# Altium schematic sheet esp32门锁.SchDoc
size A3
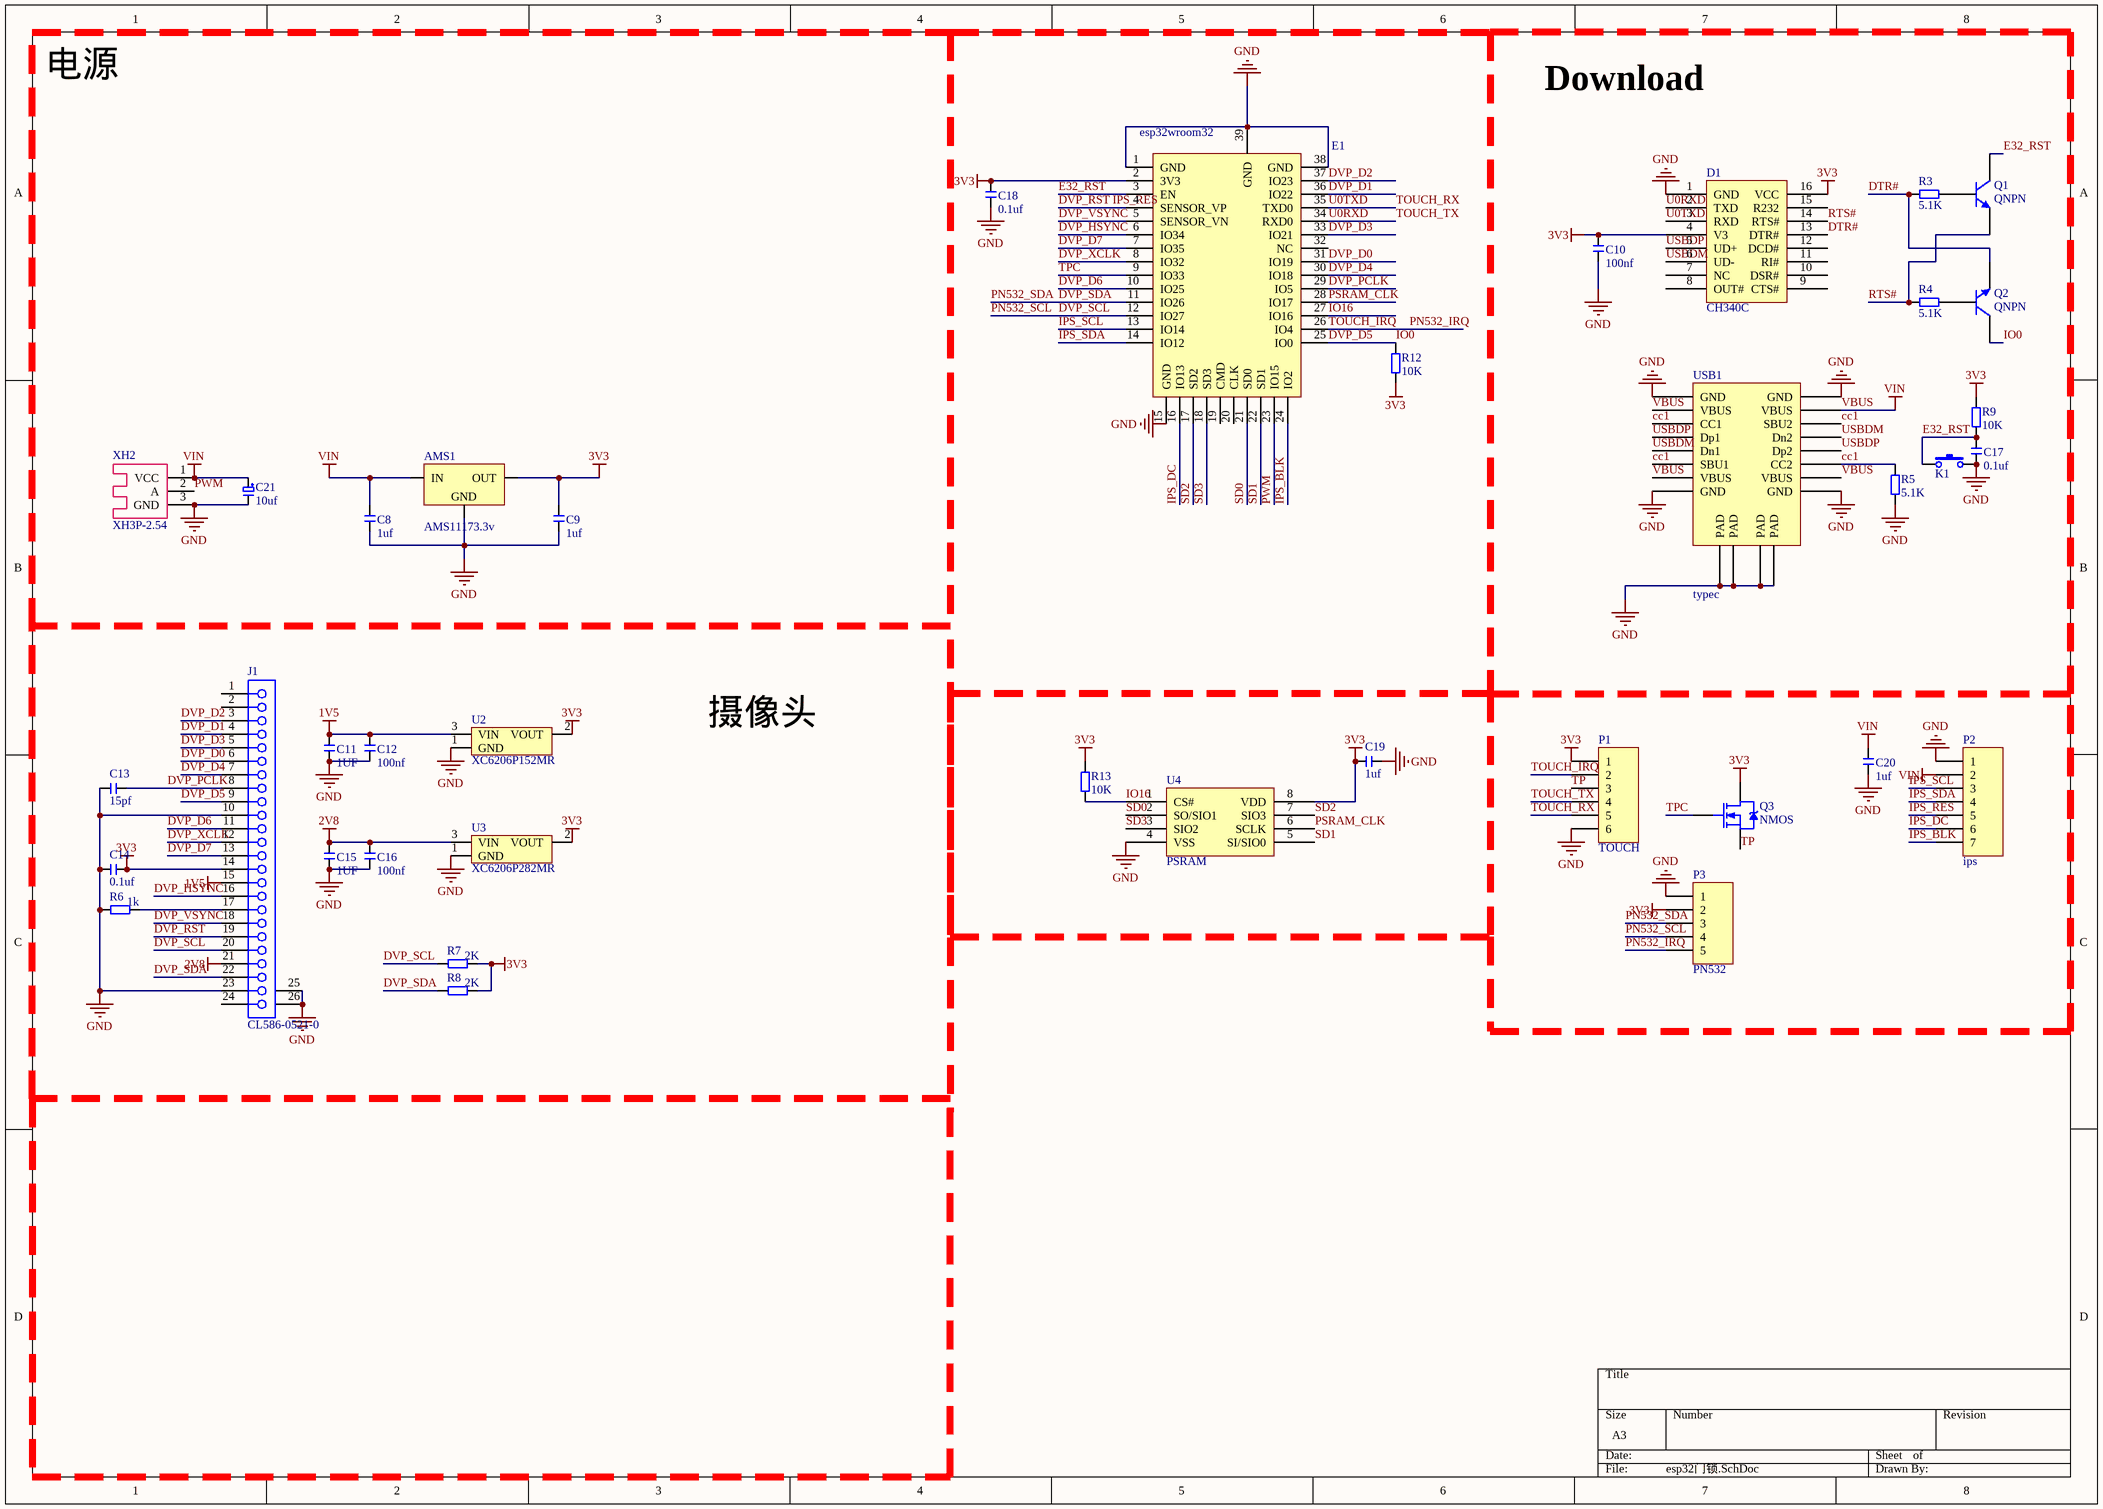
[diagram p0: esp32门锁.SchDoc]

## Parts
AMS1  AMS11173.3v  [SOT223]
C8  1uf  [C0603]
C9  1uf  [C0603]
C10  100nf  [C0603]
C11  1UF  [C0603]
C12  100nf  [C0603]
C13  15pf  [C0603]
C14  0.1uf  [C0603]
C15  1UF  [C0603]
C16  100nf  [C0603]
C17  0.1uf  [C0603]
C18  0.1uf  [C0603]
C19  1uf  [C0603]
C20  1uf  [C0603]
C21  10uf  [C4X4]
D1  CH340C  [CH340C]
E1  esp32wroom32  [esp32U]
J1  CL586-0521-0  [FH12-24S-0.5SH]
K1  Key-PB  [KEY-SMD1]  (value not drawn)
P1  TOUCH  [HDR1X6]
P2  ips  [HDR1X7]
P3  PN532  [HDR1X5]
Q1  QNPN  [SOT-23B_N]
Q2  QNPN  [SOT-23B_N]
Q3  NMOS  [SOT23]
R3  5.1K  [R0603]
R4  5.1K  [R0603]
R5  5.1K  [R0603]
R6  1k  [R0603]
R7  2K  [R0603]
R8  2K  [R0603]
R9  10K  [R0603]
R12  10K  [R0603]
R13  10K  [R0603]
U2  XC6206P152MR  [SOT23-3]
U3  XC6206P282MR  [SOT23-3]
U4  PSRAM  [PSRAM]
USB1  typec  [USB-C-SMD_TYPE-C16PIN]
XH2  XH3P-2.54  [XH2.54-3]

## Blocks framed on the sheet
电源: AMS1 C8 C9 C21 XH2
Download: C10 C17 D1 K1 Q1 Q2 R3-R5 R9 USB1

## Nets
1V5: C11.2 C12.2 J1.15 U2.3(VIN)
2V8: C15.2 C16.2 J1.21 U3.3(VIN)
3V3: AMS1.2(OUT) C9.2 C10.2 C14.1 C18.2 C19.2 D1.4(V3) D1.16(VCC) E1.2(3V3) J1.14 P1.1 P3.2 Q3.2(D) R7.1 R8.1 R9.2 R12.2 R13.1 U2.2(VOUT) U3.2(VOUT) U4.8(VDD)
GND: AMS1.1(GND) C8.1 C9.1 C10.1 C11.1 C12.1 C13.2 C14.2 C15.1 C16.1 C17.1 C18.1 C19.1 C20.2 C21.2 D1.1(GND) E1.1(GND) E1.15(GND) E1.38(GND) E1.39(GND) J1.10 J1.23 J1.25(MH1) J1.26(MH2) K1.2 P1.6 P2.1 P3.1 R5.1 R6.2 U2.1(GND) U3.1(GND) U4.4(VSS) USB1.A1B12(GND) USB1.B1A12(GND) USB1.S(PAD) XH2.3(GND)
VBUS: AMS1.3(IN) C8.2 C20.1 C21.1 P2.2 USB1.A4B9(VBUS) USB1.B4A9(VBUS) XH2.1(VCC)  [also labelled VIN]
cc1: R5.2 USB1.A5(CC1) USB1.A8(SBU1) USB1.B5(CC2) USB1.B8(SBU2)
DTR#: D1.13(DTR#) Q2.3(E) R3.2
DVP_D0: E1.31(IO19) J1.6
DVP_D1: E1.36(IO22) J1.4
DVP_D2: E1.37(IO23) J1.3
DVP_D3: E1.33(IO21) J1.5
DVP_D4: E1.30(IO18) J1.7
DVP_D5: E1.25(IO0) J1.9 Q2.1(C) R12.1  [also labelled IO0]
DVP_D6: E1.10(IO25) J1.11
DVP_D7: E1.7(IO35) J1.13
DVP_HSYNC: E1.6(IO34) J1.16
DVP_PCLK: C13.1 E1.29(IO5) J1.8
DVP_RST: E1.4(SENSOR_VP) J1.19 P2.5  [also labelled IPS_RES]
DVP_SCL: E1.12(IO27) J1.20 P3.4 R7.2  [also labelled PN532_SCL]
DVP_SDA: E1.11(IO26) J1.22 P3.3 R8.2  [also labelled PN532_SDA]
DVP_VSYNC: E1.5(SENSOR_VN) J1.18
DVP_XCLK: E1.8(IO32) J1.12
E32_RST: C17.2 E1.3(EN) K1.1 Q1.1(C) R9.1
IO16: E1.27(IO16) R13.2 U4.1(CS#)
IPS_BLK: E1.24(IO2) P2.7
IPS_DC: E1.16(IO13) P2.6
IPS_SCL: E1.13(IO14) P2.3
IPS_SDA: E1.14(IO12) P2.4
PN532_IRQ: E1.26(IO4) P1.2 P3.5  [also labelled TOUCH_IRQ]
PSRAM_CLK: E1.28(IO17) U4.6(SCLK)
PWM: E1.23(IO15) XH2.2(A)
RTS#: D1.14(RTS#) Q1.3(E) R4.2
SD0: E1.21(SD0) U4.2(SO/SIO1)
SD1: E1.22(SD1) U4.5(SI/SIO0)
SD2: E1.17(SD2) U4.7(SIO3)
SD3: E1.18(SD3) U4.3(SIO2)
TOUCH_RX: D1.3(RXD) E1.35(TXD0) P1.5  [also labelled U0TXD]
TOUCH_TX: D1.2(TXD) E1.34(RXD0) P1.4  [also labelled U0RXD]
TP: P1.3 Q3.3(S)
TPC: E1.9(IO33) Q3.1
USBDM: D1.6(UD-) USB1.A7(Dn1) USB1.B7(Dn2)
USBDP: D1.5(UD+) USB1.A6(Dp1) USB1.B6(Dp2)
NetJ1_17: J1.17 R6.1
NetQ1_2: Q1.2(B) R3.1
NetQ2_2: Q2.2(B) R4.1

Not connected (* = marked no-connect by the designer): D1 7(NC) 8(OUT#) 9(CTS#) 10(DSR#) 11(RI#) 12(DCD#) 15(R232); E1 19(CMD) 20(CLK) 32(NC); J1 1 2 24

## Notes on the sheet
- 摄像头

## Library data of the parts
AMS1 = AMS1117: Power
C8-C20 = CAP: 无极电容; accuracy: 20%
  C8 C9 C19 C20: value: 1uf
  C10 C12 C16: value: 100nf
  C11 C15: value: 1UF
  C13: value: 15pf
  C14 C17 C18: value: 0.1uf
C21 = CAP-Pole_1: 电解电容
E1 = esp32
J1 = CL586-0521-0: FH12 Series, "Flip-Lock" SMT/ZIF Connector - 0.5mm Spaced Bottom Contact; Positions: 24; ContactMaterial: Phosphor Bronze; Current: 0.4A; PCB_Layout: Complies with manufacturer's recommendation.; Published: 17-Jul-2002; DatasheetDocument: 13-Nov-2000; PackageDocument: 13-Nov-2000; PackageReference: FH12-24S-0.5SH; Publisher: Altium Limited; PadDimensions: Follow nominal values, Suitable for Wave Soldering, Adjust for Re-flow.; ComponentLink1Description: Manufacturer Link; ComponentLink1URL: http://www.hiroseusa.com/; ComponentLink2Description: Datasheet; ComponentLink2URL: http://www.hirose.co.jp/cataloge_hp/e58605370.pdf
K1 = Key-PB: 轻触开关
P1 = Header 6: Header, 6-Pin; LatestRevisionDate: 17-Jul-2002; LatestRevisionNote: Re-released for DXP Platform.; Publisher: Altium Limited
P2 = Header 7: Header, 7-Pin; LatestRevisionDate: 17-Jul-2002; LatestRevisionNote: Re-released for DXP Platform.; Publisher: Altium Limited
P3 = Header 5: Header, 5-Pin; LatestRevisionDate: 17-Jul-2002; LatestRevisionNote: Re-released for DXP Platform.; Publisher: Altium Limited
Q1 Q2 = QNPN: NPN Bipolar Transistor; Published: 8-Jun-2000; LatestRevisionDate: 29-May-2009; LatestRevisionNote: IPC-7351 Footprint Added.; PackageVersion: Aug-1999; PackageReference: SOT-23B; Publisher: Altium Limited; PackageDescription: 3-Pin SOT-23 Package 0.95 mm Pitch, 2.4 mm Lead Span
Q3 = NOMS: HEXFET Power MOSFET; Published: 8-Jun-2000; LatestRevisionDate: 17-Jul-2002; LatestRevisionNote: Re-released for DXP Platform.; DatasheetDocument: May-1998; PackageReference: D2PAK; Publisher: Altium Limited; ComponentLink1Description: Manufacturer Link; ComponentLink1URL: http://www.irf.com/
R3-R9 R12 R13 = RES: 电阻
  R3-R5: Value: 5.1K
  R6: Value: 1k
  R7 R8: Value: 2K
  R9 R12 R13: Value: 10K
U2 U3 = XC6206: LDO,SOT23,1.2~5.0V
USB1 = typec16p四脚插板
XH2 = XH3P-2.54: XH2.54小白头